# EAGLE schematic rocketnet-test (EAGLE 6.4)
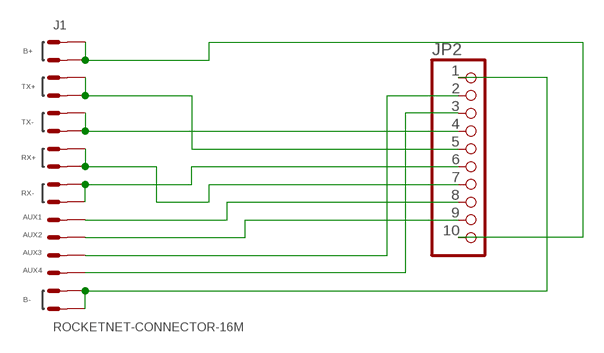
[diagram p0: schematic, sheet 1]

## Parts
J1  ROCKETNET-CONNECTOR-16M  [ROCKNET-CONNECTOR-M-16]
JP2  PINHD-1X10  [1X10]

## Nets
N$1: J1.T+@9(TX+) J1.T+@11(TX+) JP2.5
N$2: J1.R-@5(RX-) J1.R-@7(RX-) JP2.6
N$3: J1.R+@1(RX+) J1.R+@3(RX+) JP2.7
N$4: J1.T-@13(TX-) J1.T-@15(TX-) JP2.4
N$5: J1.B+@2(B+) J1.B+@4(B+) JP2.10
N$6: J1.B-@14(B-) J1.B-@16(B-) JP2.1
N$7: J1.A2(AUX2) JP2.9
N$8: J1.A1(AUX1) JP2.8
N$9: J1.A3(AUX3) JP2.2
N$10: J1.A4(AUX4) JP2.3

## Library data of the parts
J1 = rocketnet-connector:ROCKETNET-CONNECTOR-16
JP2 = pinhead:PINHD-1X10: PIN HEADER